# Altium schematic sheet Sheet2.SchDoc
size A3; SheetNumber: 1; SheetTotal: 1
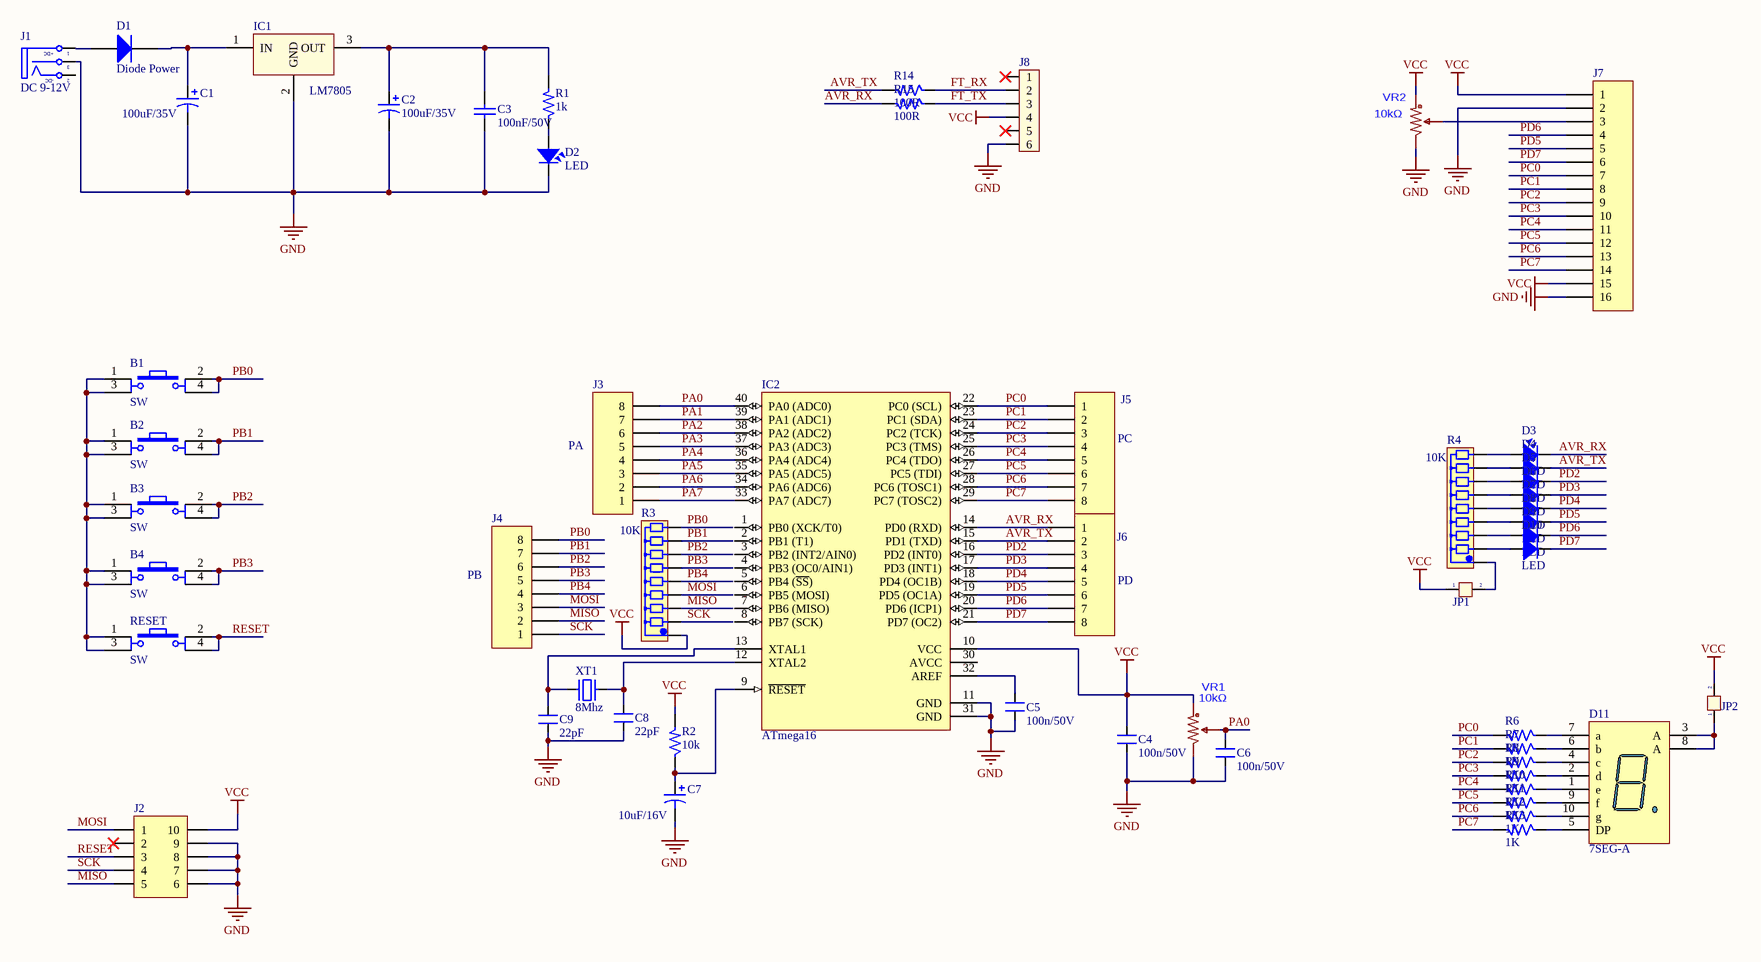
[diagram p0: Sheet2.SchDoc]

## Parts
B1  SW  [SW4]
B2  SW  [SW4]
B3  SW  [SW4]
B4  SW  [SW4]
C1  100uF/35V  [C10mm]
C2  100uF/35V  [C10mm]
C3  value 100nF/50V  [Tu-pico]  (hidden comment: Capacitor Ceramic)
C4  100n/50V  [CN1]
C5  100n/50V  [CN1]
C6  100n/50V  [CN1]
C7  10uF/16V  [C5mm]
C8  22pF  [CN1]
C9  22pF  [CN1]
D1  Diode Power  [DIODE/POW/1A]
D2  LED  [LED-5TRED]
D3  LED  [LED-5TRED]
D4  LED  [LED-5TRED]
D5  LED  [LED-5TRED]
D6  LED  [LED-5TRED]
D7  LED  [LED-5TRED]
D8  LED  [LED-5TRED]
D9  LED  [LED-5TRED]
D10  LED  [LED-5TRED]
D11  7SEG-A  [LED7SEG]
IC1  LM7805  [QTO-220]
IC2  ATmega16  [DIP40/W0.6]
J1  DC 9-12V  [DC-IN]
J2  JP5x2  [JP5-D2T]  (value not drawn)
J3  PA  [HDR1X8]
J4  PB  [HDR1X8]
J5  PC  [HDR1X8]
J6  PD  [HDR1X8]
J7  JP16  [JP16-D1T]  (value not drawn)
J8  JP6 PIN  [JP6]  (value not drawn)
JP1  Jumper 2  [JP2]  (value not drawn)
JP2  Jumper 2  [JP2]  (value not drawn)
R1  1k  [R1/4W]
R2  10k  [R1/4W]
R3  10K  [RN8]
R4  10K  [RN8]
R6  1K  [R1/4W]
R7  1K  [R1/4W]
R8  1K  [R1/4W]
R9  1K  [R1/4W]
R10  1K  [R1/4W]
R11  1K  [R1/4W]
R12  1K  [R1/4W]
R13  1K  [R1/4W]
R14  100R  [R1/4W]
R15  100R  [R1/4W]
RESET  SW  [SW4]
VR1  10kΩ  [RES-ADJ-SMD_RM065-V1]
VR2  10kΩ  [RES-ADJ-SMD_RM065-V1]
XT1  8Mhz  [XT2]

## Nets
GND: C1.2 C2.2 C3.1 C4.2 C5.2 C6.2 C7.2 C8.1 C9.1 D2.2 IC1.2(GND) IC2.11(GND) IC2.31(GND) J1.3(S) J2.6 J2.7 J2.8 J2.9 J7.2 J7.16 J8.6 VR1.3 VR2.3
VCC: C4.1 IC2.10(VCC) J2.10 J7.1 J7.15 J8.4 JP1.1 JP2.2 R2.2 R3.1 VR1.1 VR2.1
AVR_RX: D3.2 IC2.14(PD0_(RXD)) J6.1 R15.2
AVR_TX: D4.2 IC2.15(PD1_(TXD)) J6.2 R14.2
FT_RX: J8.2 R14.1
FT_TX: J8.3 R15.1
MISO: J2.5 J4.2 R3.3
MOSI: J2.1 J4.3 R3.4
PA0: C6.1 IC2.40(PA0_(ADC0)) J3.8 VR1.2
PA1: IC2.39(PA1_(ADC1)) J3.7
PA2: IC2.38(PA2_(ADC2)) J3.6
PA3: IC2.37(PA3_(ADC3)) J3.5
PA4: IC2.36(PA4_(ADC4)) J3.4
PA5: IC2.35(PA5_(ADC5)) J3.3
PA6: IC2.34(PA6_(ADC6)) J3.2
PA7: IC2.33(PA7_(ADC7)) J3.1
PB0: B1.2 B1.4 J4.8 R3.9
PB1: B2.2 B2.4 J4.7 R3.8
PB2: B3.2 B3.4 J4.6 R3.7
PB3: B4.2 B4.4 J4.5 R3.6
PB4: J4.4 R3.5
PC0: IC2.22(PC0_(SCL)) J5.1 J7.7 R6.2
PC1: IC2.23(PC1_(SDA)) J5.2 J7.8 R7.2
PC2: IC2.24(PC2_(TCK)) J5.3 J7.9 R8.2
PC3: IC2.25(PC3_(TMS)) J5.4 J7.10 R9.2
PC4: IC2.26(PC4_(TDO)) J5.5 J7.11 R10.2
PC5: IC2.27(PC5_(TDI)) J5.6 J7.12 R11.2
PC6: IC2.28(PC6_(TOSC1)) J5.7 J7.13 R12.2
PC7: IC2.29(PC7_(TOSC2)) J5.8 J7.14 R13.2
PD2: D5.2 IC2.16(PD2_(INT0)) J6.3
PD3: D6.2 IC2.17(PD3_(INT1)) J6.4
PD4: D7.2 IC2.18(PD4_(OC1B)) J6.5
PD5: D8.2 IC2.19(PD5_(OC1A)) J6.6 J7.5
PD6: D9.2 IC2.20(PD6_(ICP1)) J6.7 J7.4
PD7: D10.2 IC2.21(PD7_(OC2)) J6.8 J7.6
RESET: J2.3 RESET.2 RESET.4
SCK: J2.4 J4.1 R3.2
NetB1_1: B1.1 B1.3 B2.1 B2.3 B3.1 B3.3 B4.1 B4.3 RESET.1 RESET.3
NetC1_1: C1.1 D1.2(K) IC1.1(IN)
NetC2_1: C2.1 C3.2 IC1.3(OUT) R1.2
NetC5_1: C5.1 IC2.32(AREF)
NetC7_1: C7.1 IC2.9(~{RESET}) R2.1
NetC8_2: C8.2 IC2.12(XTAL2) XT1.2
NetC9_2: C9.2 IC2.13(XTAL1) XT1.1
NetD1_1: D1.1(A) J1.1(T)
NetD2_1: D2.1 R1.1
NetD3_1: D3.1 R4.9
NetD4_1: D4.1 R4.8
NetD5_1: D5.1 R4.7
NetD6_1: D6.1 R4.6
NetD7_1: D7.1 R4.5
NetD8_1: D8.1 R4.4
NetD9_1: D9.1 R4.3
NetD10_1: D10.1 R4.2
NetD11_1: D11.1(e) R10.1
NetD11_2: D11.2(d) R9.1
NetD11_3: D11.3(A) D11.8(A) JP2.1
NetD11_4: D11.4(c) R8.1
NetD11_5: D11.5(DP) R13.1
NetD11_6: D11.6(b) R7.1
NetD11_7: D11.7(a) R6.1
NetD11_9: D11.9(f) R11.1
NetD11_10: D11.10(g) R12.1
NetJ7_3: J7.3 VR2.2
NetJP1_2: JP1.2 R4.1

Not connected (* = marked no-connect by the designer): IC2 1(PB0_(XCK/T0)) 2(PB1_(T1)) 3(PB2_(INT2/AIN0)) 4(PB3_(OC0/AIN1)) 5(PB4_(~{SS})) 6(PB5_(MOSI)) 7(PB6_(MISO)) 8(PB7_(SCK)) 30(AVCC); J1 2(TN); J2 2*; J8 1* 5*

## Notes on the sheet
- (in symbol DCIN) +DC; -DC

## Library data of the parts
B1-B4 RESET = SW4: Switch button 4 pin; Value: Button chip 4 pin
C1 C2 = Cap Pol 8mm: Polarized Capacitor (Axial); Published: 8-Jun-2000; LatestRevisionDate: 17-Jul-2002; LatestRevisionNote: Re-released for DXP Platform.; PackageReference: POLAR0.8; Publisher: Altium Limited
C3 = CapCeramic: Capacitor; Published: 8-Jun-2000; LatestRevisionDate: 17-Jul-2002; LatestRevisionNote: Re-released for DXP Platform.; PackageReference: RAD-0.3; Publisher: Altium Limited
C4-C6 C8 C9 = CN1: Cap np  1pF - 472pF; Value: 100pF
C7 = Cap Pol 5mm: Polarized Capacitor (Axial); Published: 8-Jun-2000; LatestRevisionDate: 17-Jul-2002; LatestRevisionNote: Re-released for DXP Platform.; PackageReference: POLAR0.8; Publisher: Altium Limited
D2-D10 = LED: LED Single colour Green and Red; Value: LED 3 ly Single Colour
D11 = LED7SEG-A: 14.2 mm General Purpose Blue 7-Segment Display: CA, RH DP, Gray Surface; MinimumIntensity: 2020 ucd; Note: IF = 10 mA; Published: 8-Jun-2000; LatestRevisionDate: 17-Dec-2003; LatestRevisionNote: Schematic revised, PCB Footprint replaced.; DatasheetDocument: 24-Sep-2002; PackageDocument: 24-Sep-2002; PackageReference: H; Publisher: Altium Limited; Colour: Blue; ComponentLink1Description: Manufacturer Link; ComponentLink1URL: http://www.agilent.com/
IC1 = LM78xx: On ap +, from + 5 to + 24VDC; Value: LM7805
IC2 = ATmega16A-PU: 8-Bit AVR Microcontroller with 16K Bytes of In-System Programmable Flash Memory; Value: Atmega 16L
J1 = DCIN: Jac DC input; Value: Jac DC
J2 = JP5x2: WR-PHD 2.54 mm Dual Socket Header; Manufacturer: W¨¹rth Elektronik eiSos GmbH; partNo: 61301021821; ComponentLink1 Description: Manufacturer; ComponentLink2 Description: Datasheet; NoPins: 10; Created Date: 29 March 2013; ComponentLink1URL: http://www.we-online.com; ComponentLink2URL: http://katalog.we-online.de/em/datasheet/6130xx21821.pdf; Created by: Karrer Zheng
J3-J6 = Header 8: Header, 8-Pin; LatestRevisionDate: 17-Jul-2002; LatestRevisionNote: Re-released for DXP Platform.; Publisher: Altium Limited
J7 = JP16: WR-PHD 2.54 mm Angled Socket Header; Manufacturer: W¨¹rth Elektronik eiSos GmbH; partNo: 613016143121; ComponentLink1 Description: Manufacturer; ComponentLink2 Description: Datasheet; NoPins: 16; Created Date: 29 March 2013; ComponentLink1URL: http://www.we-online.com; ComponentLink2URL: http://katalog.we-online.de/em/datasheet/6130xx143121.pdf; Created by: Karrer Zheng
J8 = JP6: Value: JP7
JP1 JP2 = JP 2: Value: JP 2
R1 R2 R6-R15 = R: Resistor 1/4W; Value: R1/4W - 1K
R3 R4 = RN8: Resistor 8 (Thanh); Value: Tro thanh 10K
VR1 VR2 = VR-RM065-103(10K): VR-10K
XT1 = XT2: Crystal For all Crystal 2pin.; Value: 4Mhz
D1 = Diode Power: Published: 8-Jun-2000; LatestRevisionDate: 17-Jul-2002; LatestRevisionNote: Re-released for DXP Platform.; DatasheetDocument: 1998; PackageDocument: Aug-1999; PackageReference: DO-201AD; Publisher: Altium Limited; ComponentLink1Description: Manufacturer Link; ComponentLink1URL: http://www.fairchildsemi.com/; ComponentLink2Description: Datasheet; ComponentLink2URL: http://www.fairchildsemi.com/ds/1N%2F1N5400.pdf